# EAGLE schematic C2 (EAGLE 7.5.0)

## Sheet 1 of 2: Schematic1/2
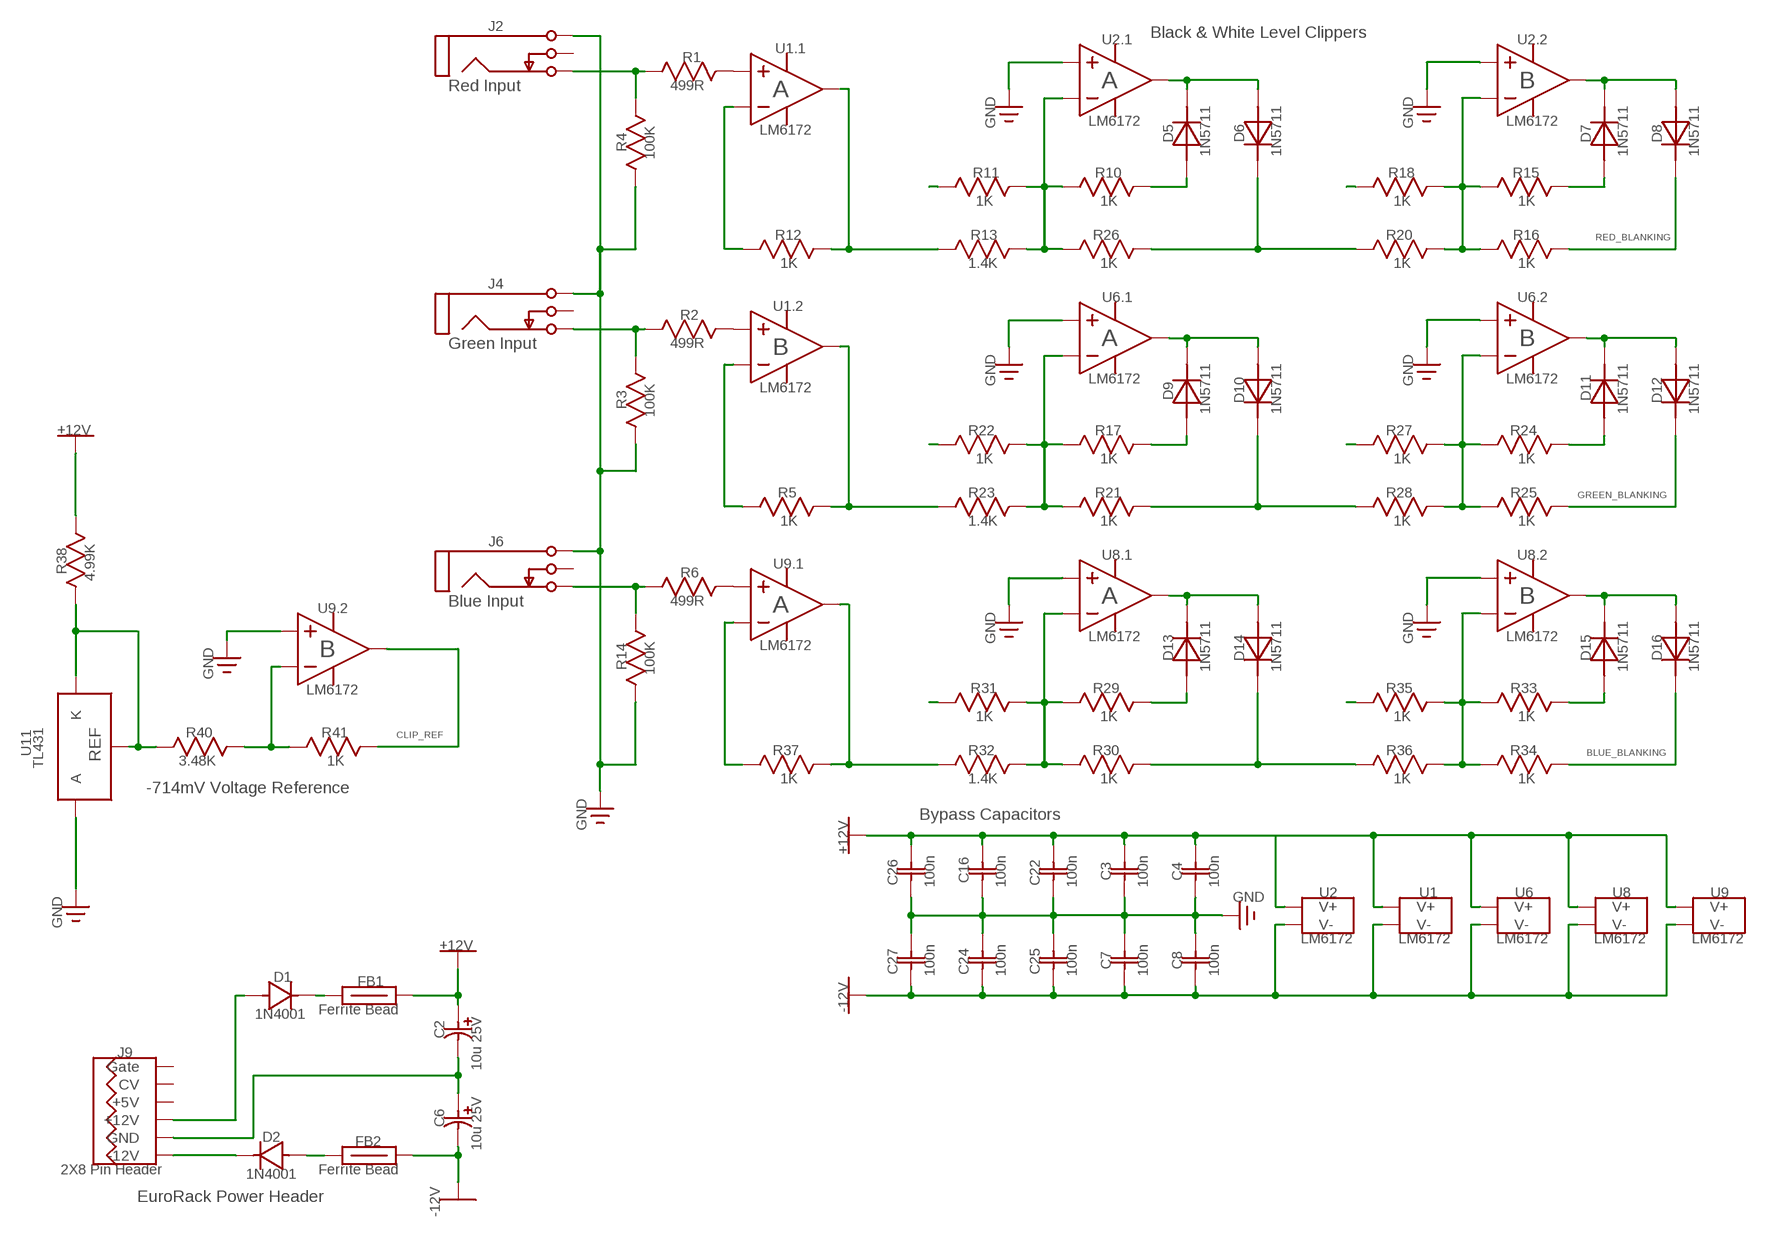
[diagram p0: schematic, sheet 1]

### Parts
C2  10u 25V  EC80-5  [CAPPR-2/5.08]
C3  100n  CAP100  [CAP-2.54/6.6X3]
C4  100n  CAP100  [CAP-2.54/6.6X3]
C6  10u 25V  EC80-5  [CAPPR-2/5.08]
C7  100n  CAP100  [CAP-2.54/6.6X3]
C8  100n  CAP100  [CAP-2.54/6.6X3]
C16  100n  CAP100  [CAP-2.54/6.6X3]
C22  100n  CAP100  [CAP-2.54/6.6X3]
C24  100n  CAP100  [CAP-2.54/6.6X3]
C25  100n  CAP100  [CAP-2.54/6.6X3]
C26  100n  CAP100  [CAP-2.54/6.6X3]
C27  100n  CAP100  [CAP-2.54/6.6X3]
D1  1N4001  [DO-41]
D2  1N4001  [DO-41]
D5  1N5711  [DO-35]
D6  1N5711  [DO-35]
D7  1N5711  [DO-35]
D8  1N5711  [DO-35]
D9  1N5711  [DO-35]
D10  1N5711  [DO-35]
D11  1N5711  [DO-35]
D12  1N5711  [DO-35]
D13  1N5711  [DO-35]
D14  1N5711  [DO-35]
D15  1N5711  [DO-35]
D16  1N5711  [DO-35]
FB1  68R  FERRITE_BEAD  [FB-10.16/4.45X3.5]
FB2  68R  FERRITE_BEAD  [FB-10.16/4.45X3.5]
J2  3.5MM_JACK  [PJ302M]
J4  3.5MM_JACK  [PJ302M]
J6  3.5MM_JACK  [PJ302M]
J9  2X8_PIN_HEADER  [IDC16M]
R1  499R  RES300  [RES-7.62/5.1X2.5]
R2  499R  RES300  [RES-7.62/5.1X2.5]
R3  100K  RES300  [RES-7.62/5.1X2.5]
R4  100K  RES300  [RES-7.62/5.1X2.5]
R5  1K  RES300  [RES-7.62/5.1X2.5]
R6  499R  RES300  [RES-7.62/5.1X2.5]
R10  1K  RES300  [RES-7.62/5.1X2.5]
R11  1K  RES300  [RES-7.62/5.1X2.5]
R12  1K  RES300  [RES-7.62/5.1X2.5]
R13  1.4K  RES300  [RES-7.62/5.1X2.5]
R14  100K  RES300  [RES-7.62/5.1X2.5]
R15  1K  RES300  [RES-7.62/5.1X2.5]
R16  1K  RES300  [RES-7.62/5.1X2.5]
R17  1K  RES300  [RES-7.62/5.1X2.5]
R18  1K  RES300  [RES-7.62/5.1X2.5]
R20  1K  RES300  [RES-7.62/5.1X2.5]
R21  1K  RES300  [RES-7.62/5.1X2.5]
R22  1K  RES300  [RES-7.62/5.1X2.5]
R23  1.4K  RES300  [RES-7.62/5.1X2.5]
R24  1K  RES300  [RES-7.62/5.1X2.5]
R25  1K  RES300  [RES-7.62/5.1X2.5]
R26  1K  RES300  [RES-7.62/5.1X2.5]
R27  1K  RES300  [RES-7.62/5.1X2.5]
R28  1K  RES300  [RES-7.62/5.1X2.5]
R29  1K  RES300  [RES-7.62/5.1X2.5]
R30  1K  RES300  [RES-7.62/5.1X2.5]
R31  1K  RES300  [RES-7.62/5.1X2.5]
R32  1.4K  RES300  [RES-7.62/5.1X2.5]
R33  1K  RES300  [RES-7.62/5.1X2.5]
R34  1K  RES300  [RES-7.62/5.1X2.5]
R35  1K  RES300  [RES-7.62/5.1X2.5]
R36  1K  RES300  [RES-7.62/5.1X2.5]
R37  1K  RES300  [RES-7.62/5.1X2.5]
R38  4.99K  RES300  [RES-7.62/5.1X2.5]
R40  3.48K  RES300  [RES-7.62/5.1X2.5]
R41  1K  RES300  [RES-7.62/5.1X2.5]
U1  LM6172  [DIP-8]
U2  LM6172  [DIP-8]
U6  LM6172  [DIP-8]
U8  LM6172  [DIP-8]
U9  LM6172  [DIP-8]
U11  TL431  [TO-92-100R]

### Nets
0V: C2.2(MINUS) C6.1(PLUS) J9.3(GND) J9.4(GND) J9.5(GND)
+12V: C2.1(PLUS) C3.1 C4.1 C16.1 C22.1 C26.1 FB1.2 R38.2(B) U1.8(VCC_AND_GND:V+) U2.8(VCC_AND_GND:V+) U6.8(VCC_AND_GND:V+) U8.8(VCC_AND_GND:V+) U9.8(VCC_AND_GND:V+) ; also sheet 2
-12V: C6.2(MINUS) C7.2 C8.2 C24.2 C25.2 C27.2 FB2.2 U1.4(VCC_AND_GND:V-) U2.4(VCC_AND_GND:V-) U6.4(VCC_AND_GND:V-) U8.4(VCC_AND_GND:V-) U9.4(VCC_AND_GND:V-) ; also sheet 2
BLUE_BLANKING: D16.1(K) R34.2(B) ; also sheet 2
CLIP_REF: R11.1(A) R18.1(A) R22.1(A) R27.1(A) R31.1(A) R35.1(A) R41.2(B) U9.7(PART_2:OUT)
GREEN_BLANKING: D12.1(K) R25.2(B) ; also sheet 2
Net_1: D2.2(A) FB2.1
Net_2: D1.1(K) FB1.1
Net_3: R5.1(A) U1.6(PART_2:IN-)
Net_5: D2.1(K) J9.1(-12V) J9.2(-12V)
Net_6: J4.3A(Tip) J4.3B(Tip) R2.1(A) R3.2(B)
Net_9: J2.3A(Tip) J2.3B(Tip) R1.1(A) R4.2(B)
Net_12: R2.2(B) U1.5(PART_2:IN+)
Net_13: R12.2(B) R13.1(A) U1.1(PART_1:OUT)
Net_14: R24.1(A) R25.1(A) R27.2(B) R28.2(B) U6.6(PART_2:IN-)
Net_16: R15.1(A) R16.1(A) R18.2(B) R20.2(B) U2.6(PART_2:IN-)
Net_17: D7.1(K) D8.2(A) U2.7(PART_2:OUT)
Net_19: D7.2(A) R15.2(B)
Net_20: D11.1(K) D12.2(A) U6.7(PART_2:OUT)
Net_21: R10.1(A) R11.2(B) R13.2(B) R26.1(A) U2.2(PART_1:IN-)
Net_22: D5.1(K) D6.2(A) U2.1(PART_1:OUT)
Net_23: D11.2(A) R24.2(B)
Net_24: R17.1(A) R21.1(A) R22.2(B) R23.2(B) U6.2(PART_1:IN-)
Net_25: D9.1(K) D10.2(A) U6.1(PART_1:OUT)
Net_26: D9.2(A) R17.2(B)
Net_27: D10.1(K) R21.2(B) R28.1(A)
Net_29: R33.1(A) R34.1(A) R35.2(B) R36.2(B) U8.6(PART_2:IN-)
Net_30: D15.1(K) D16.2(A) U8.7(PART_2:OUT)
Net_31: D15.2(A) R33.2(B)
Net_32: R29.1(A) R30.1(A) R31.2(B) R32.2(B) U8.2(PART_1:IN-)
Net_33: D1.2(A) J9.9(+12V) J9.10(+12V)
Net_34: D13.1(K) D14.2(A) U8.1(PART_1:OUT)
Net_36: D13.2(A) R29.2(B)
Net_45: D5.2(A) R10.2(B)
Net_46: D6.1(K) R20.1(A) R26.2(B)
Net_49: D14.1(K) R30.2(B) R36.1(A)
Net_50: R1.2(B) U1.3(PART_1:IN+)
Net_52: R12.1(A) U1.2(PART_1:IN-)
Net_53: C3.2 C4.2 C7.1 C8.1 C16.2 C22.2 C24.1 C25.1 C26.2 C27.1 J2.1A(Sleeve) J2.1B(Sleeve) J4.1A(Sleeve) J4.1B(Sleeve) J6.1A(Sleeve) J6.1B(Sleeve) R3.1(A) R4.1(A) R14.1(A) U2.3(PART_1:IN+) U2.5(PART_2:IN+) U6.3(PART_1:IN+) U6.5(PART_2:IN+) U8.3(PART_1:IN+) U8.5(PART_2:IN+) U9.5(PART_2:IN+) U11.2(A) ; supply symbol labelled GND, GND_10 ; also sheet 2
Net_54: J6.3A(Tip) J6.3B(Tip) R6.1(A) R14.2(B)
Net_61: R5.2(B) R23.1(A) U1.7(PART_2:OUT)
Net_62: R6.2(B) U9.3(PART_1:IN+)
Net_64: R37.1(A) U9.2(PART_1:IN-)
Net_65: R32.1(A) R37.2(B) U9.1(PART_1:OUT)
Net_67: R38.1(A) R40.1(A) U11.1(K) U11.3(REF)
Net_68: R40.2(B) R41.1(A) U9.6(PART_2:IN-)
RED_BLANKING: D8.1(K) R16.2(B) ; also sheet 2
Unconnected: J2.2A(Switch) J2.2B(Switch) J4.2A(Switch) J4.2B(Switch) J6.2A(Switch) J6.2B(Switch) J9.11(+5V) J9.12(+5V) J9.13(CV) J9.14(CV) J9.15(Gate) J9.16(Gate)

### Notes on the sheet
- Black & White Level Clippers
- J2
- U2.1 | U2.2
- U1.1
- R1
- A | B
- Red Input | 499R | A
- LM6172 | LM6172
- LM6172 | GND | GND
- D5 | D6 | D7 | D8
- R4
- 100K | 1N5711 | 1N5711 | 1N5711 | 1N5711
- R11 | R10 | R18 | R15
- 1K | 1K | 1K | 1K
- RED_BLANKING
- R12 | R13 | R26 | R20 | R16
- 1K | 1.4K | 1K | 1K | 1K
- J4
- U6.1 | U6.2
- U1.2
- R2
- A | B
- Green Input | 499R | B
- LM6172 | LM6172
- LM6172 | GND | GND
- D9 | D10 | D11 | D12
- R3
- 100K | 1N5711 | 1N5711 | 1N5711 | 1N5711
- +12V | R22 | R17 | R27 | R24
- 1K | 1K | 1K | 1K
- GREEN_BLANKING
- R5 | R23 | R21 | R28 | R25
- 1K | 1.4K | 1K | 1K | 1K
- J6
- U8.1 | U8.2
- U9.1
- R38 | R6
- 4.99K
- A | B
- Blue Input | 499R | A
- U9.2
- LM6172 | LM6172
- B | LM6172 | GND | GND
- D13 | D14 | D15 | D16
- R14 | 1N5711 | 1N5711 | 1N5711 | 1N5711
- 100K
- GND
- LM6172
- R31 | R29 | R35 | R33
- 1K | 1K | 1K | 1K
- CLIP_REF
- R40 | R41
- BLUE_BLANKING
- U11 | 3.48K | 1K | R37 | R32 | R30 | R36 | R34
- REF
- TL431
- 1K | 1.4K | 1K | 1K | 1K
- -714mV Voltage Reference
- Bypass Capacitors
- GND
- +12V
- C16 | C3 | C4
- C26 | 100n | 100n | C22 | 100n | 100n | 100n
- U2 | U1 | U6 | U8 | U9
- GND
- GND
- LM6172 | LM6172 | LM6172 | LM6172 | LM6172
- +12V
- C7 | C8
- C27 | 100n | C24 | 100n | C25 | 100n | 100n | 100n
- D1
- FB1
- Ferrite Bead
- 1N4001 | -12V
- C2
- J9
- 10u 25V
- C6
- D2
- FB2 | 10u 25V
- 2X8 Pin Header | Ferrite Bead
- 1N4001
- EuroRack Power Header
- -12V

## Sheet 2 of 2: Schematic2/2
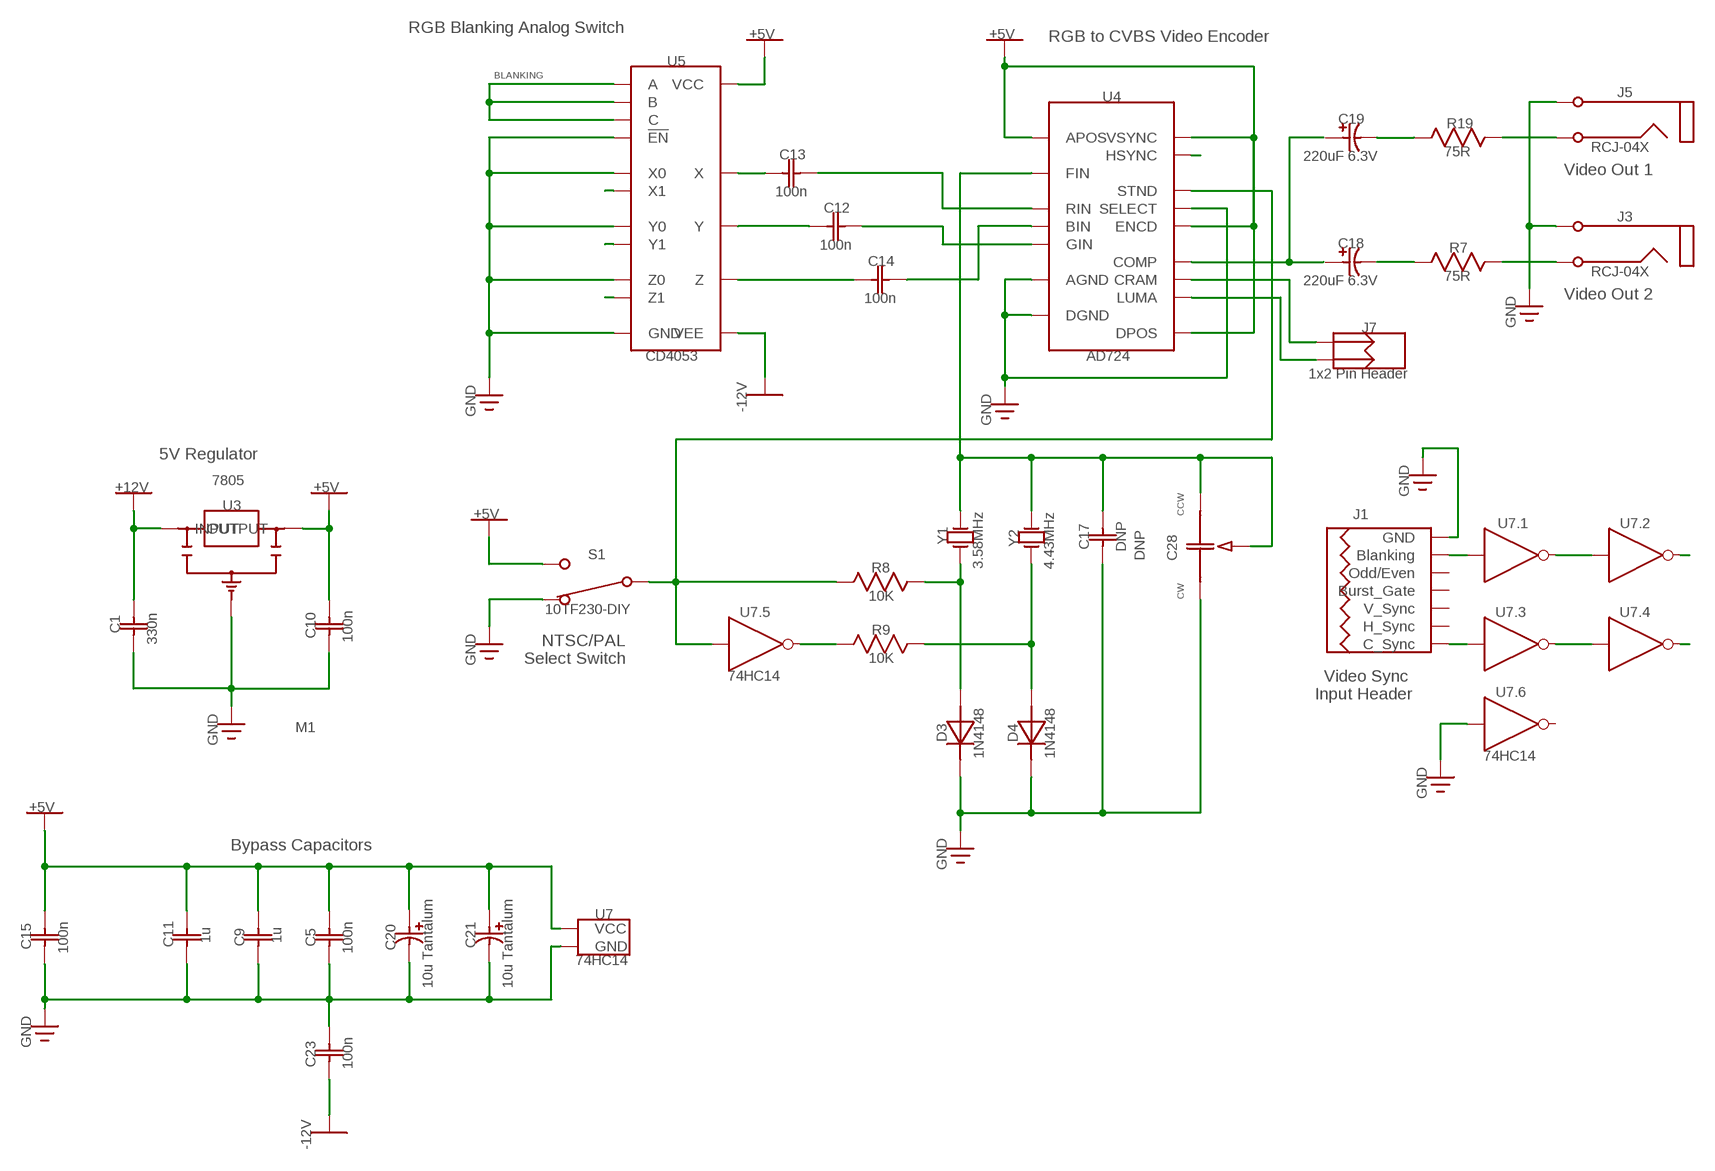
[diagram p1: schematic, sheet 2]

### Parts
C1  330n  CAP100  [CAP-2.54/6.6X3]
C5  100n  CAP100  [CAP-2.54/6.6X3]
C9  1u  CAP100  [CAP-2.54/6.6X3]
C10  100n  CAP100  [CAP-2.54/6.6X3]
C11  1u  CAP100  [CAP-2.54/6.6X3]
C12  100n  CAP100  [CAP-2.54/6.6X3]
C13  100n  CAP100  [CAP-2.54/6.6X3]
C14  100n  CAP100  [CAP-2.54/6.6X3]
C15  100n  CAP100  [CAP-2.54/6.6X3]
C17  DNP  CAP100  [CAP-2.54/6.6X3]
C18  220uF 6.3V  EC80-5  [CAPPR-2/5.08]
C19  220uF 6.3V  EC80-5  [CAPPR-2/5.08]
C20  10u Tantalum  TANT100  [PCAP-2.54/6.6X3]
C21  10u Tantalum  TANT100  [PCAP-2.54/6.6X3]
C23  100n  CAP100  [CAP-2.54/6.6X3]
C28  DNP  GYA22000  [GYA22000]
D3  1N4148  [DO-35]
D4  1N4148  [DO-35]
J1  LZXSYNC14  [IDC14M]
J3  RCJ-04X  [RCJ-04X]
J5  RCJ-04X  [RCJ-04X]
J7  1X2_PIN_HEADER  [HDR-2X1T/2.54X2.54/3X5]
M1  KEYSTONE621  [KEYSTONE621]
R7  75R  RES300  [RES-7.62/5.1X2.5]
R8  10K  RES300  [RES-7.62/5.1X2.5]
R9  10K  RES300  [RES-7.62/5.1X2.5]
R19  75R  RES300  [RES-7.62/5.1X2.5]
S1  10TF230-DIY  [10TF230-DIY]
U3  7805  [TO-220H]
U4  AD724  [SOIC-16/300MIL]
U5  CD4053  [DIP-16]
U7  74HC14  [DIP-14]
Y1  3.58MHz  ECS-10-13-1  [HC-49U]
Y2  4.43MHz  ECS-10-13-1  [HC-49U]

### Nets
+5V: C5.1 C9.1 C10.1 C11.1 C15.1 C20.1(PLUS) C21.1(PLUS) S1.3(C2) S1.3B(C2) U3.3(OUTPUT) U4.4(APOS) U4.5(ENCD) U4.14(DPOS) U4.15(VSYNC) U5.16(VCC) U7.14(VCC_AND_GND:VCC)
+12V: C1.1 U3.1(INPUT) ; also sheet 1
-12V: C23.2 U5.7(VEE) ; also sheet 1
BLANKING: U5.9(C) U5.10(B) U5.11(A) U7.4(PART_2:Y)
BLUE_BLANKING: U5.3(Z1) ; also sheet 1
CSYNC: U4.16(HSYNC) U7.8(PART_4:Y)
GREEN_BLANKING: U5.1(Y1) ; also sheet 1
Net_0: J5.2(Tip) R19.2(B)
Net_4: J1.13(C_Sync) J1.14(C_Sync) U7.5(PART_3:A)
Net_7: C12.2 U4.7(GIN)
Net_8: U7.6(PART_3:Y) U7.9(PART_4:A)
Net_10: C18.1(PLUS) C19.1(PLUS) U4.10(COMP)
Net_11: C14.1 U5.4(Z)
Net_15: C14.2 U4.8(BIN)
Net_18: C13.2 U4.6(RIN)
Net_28: J3.2(Tip) R7.2(B)
Net_35: D3.2(A) R8.1(A) Y1.1(OSC1)
Net_37: D4.2(A) R9.1(A) Y2.1(OSC1)
Net_38: C17.1 C28.CCW C28.W U4.3(FIN) Y1.2(OSC2) Y2.2(OSC2)
Net_39: R8.2(B) S1.2(C1) S1.2B(C1) U4.1(STND) U7.11(PART_5:A)
Net_40: R9.2(B) U7.10(PART_5:Y)
Net_41: C12.1 U5.15(Y)
Net_42: C13.1 U5.14(X)
Net_43: C19.2(MINUS) R19.1(A)
Net_44: C18.2(MINUS) R7.1(A)
Net_47: J1.3(Blanking) J1.4(Blanking) U7.1(PART_1:A)
Net_48: U7.2(PART_1:Y) U7.3(PART_2:A)
Net_53: C1.2 C5.2 C9.2 C10.2 C11.2 C15.2 C17.2 C20.2(MINUS) C21.2(MINUS) C23.1 C28.CW D3.1(K) D4.1(K) J1.1(GND) J1.2(GND) J3.1(Sleeve) J5.1(Sleeve) S1.1(C3) S1.1B(C3) U3.2(GND) U4.2(AGND) U4.12(SELECT) U4.13(DGND) U5.2(Y0) U5.5(Z0) U5.6(!EN) U5.8(GND) U5.12(X0) U7.7(VCC_AND_GND:GND) U7.13(PART_6:A) ; supply symbol labelled GND ; also sheet 1
Net_70: J7.1 U4.9(CRAM)
Net_71: J7.2 U4.11(LUMA)
RED_BLANKING: U5.13(X1) ; also sheet 1
Unconnected: J1.5(Odd/Even) J1.6(Odd/Even) J1.7(Burst_Gate) J1.8(Burst_Gate) J1.9(V_Sync) J1.10(V_Sync) J1.11(H_Sync) J1.12(H_Sync) U7.12(PART_6:Y)

### Notes on the sheet
- RGB Blanking Analog Switch
- RGB to CVBS Video Encoder
- +5V | +5V
- U5
- BLANKING
- J5
- U4
- C19
- R19
- RCJ-04X
- 75R
- 220uF 6.3V
- C13 | Video Out 1
- 100n
- C12
- J3
- 100n
- C18
- R7
- C14 | RCJ-04X
- 75R
- 220uF 6.3V
- Video Out 2
- 100n
- GND
- J7
- CD4053 | AD724
- 1x2 Pin Header
- -12V
- GND
- GND
- 5V Regulator
- 7805
- +12V | +5V | GND
- U3
- CCW
- +5V | J1
- U7.1 | U7.2
- Y1 | Y2
- C17 | DNP
- S1 | DNP | C28
- R8 | 3.58MHz | 4.43MHz
- 10K
- CW
- 10TF230-DIY
- U7.5 | U7.3 | U7.4
- C1 | NTSC/PAL | R9
- C10
- 330n | 100n
- Select Switch | 10K
- GND
- 74HC14 | Video Sync
- Input Header
- U7.6
- M1
- GND | D3 | D4
- 74HC14
- 1N4148 | 1N4148
- GND
- +5V
- Bypass Capacitors
- GND
- U7
- C11 | 1u | C9 | 1u | C5
- C15 | C20 | C21
- 100n | 100n | 74HC14
- 10u Tantalum | 10u Tantalum
- GND
- C23 | 100n
- -12V

## Library data of the parts
C1 = common:CAP100
C2 C6 = common:EC80-5
C3-C5 C7-C17 C22-C27 = common:CAP100; VALUE: 330n
C18 C19 = common:EC80-5; VALUE: 10u 25V
C20 C21 = common:TANT100
C28 = common:GYA22000
D1 D2 = common:1N4001
D3 D4 = common:1N4148; DATASHEET: http://datasheets.diptrace.com\fairchild\1N4148.pdf; MANUFACTURER: Fairchild
D5-D16 = common:1N5711; DATASHEET: http://datasheets.diptrace.com\fairchild\1N4148.pdf; MANUFACTURER: Fairchild
FB1 FB2 = common:FERRITE_BEAD; MANUFACTURER: Fair-Rite
J1 = common:LZXSYNC14
J2 J4 J6 = common:3.5MM_JACK; DATASHEET: http://www.thonk.co.uk/shop/pj302m/
J3 J5 = common:RCJ-04X
J7 = common:1X2_PIN_HEADER; DATASHEET: http://datasheets.diptrace.com\con_headers\901310126_sd.pdf; MANUFACTURER: Molex
J9 = common:2X8_PIN_HEADER
M1 = common:KEYSTONE621
R1 R2 R6 = common:RES300
R3-R5 R7-R38 R40 R41 = common:RES300; VALUE: 499R
S1 = common:10TF230-DIY
U1 U2 U6 U8 U9 = common:LM6172; DATASHEET: http://datasheets.diptrace.com\ti\TL07x.pdf; MANUFACTURER: Texas Instruments
U3 = common:7805; MANUFACTURER: Atmel
U4 = common:AD724; DATASHEET: http://datasheets.diptrace.com\analog_devices\AD724.pdf; MANUFACTURER: Analog Devices
U5 = common:CD4053; DATASHEET: http://datasheets.diptrace.com\fairchild\CD4051BC.pdf; MANUFACTURER: Fairchild
U7 = common:74HC14; MANUFACTURER: National Semiconductor
U11 = common:TL431; DATASHEET: http://datasheets.diptrace.com\st_micro\CD00000986.pdf; MANUFACTURER: ST Microelectronics
Y1 = common:ECS-10-13-1; DATASHEET: http://datasheets.diptrace.com\crystals\ECS-HC49U.pdf
Y2 = common:ECS-10-13-1; DATASHEET: http://datasheets.diptrace.com\crystals\ECS-HC49U.pdf; VALUE: 3.58MHz